# EAGLE design battery_case (EAGLE 9.6.2)
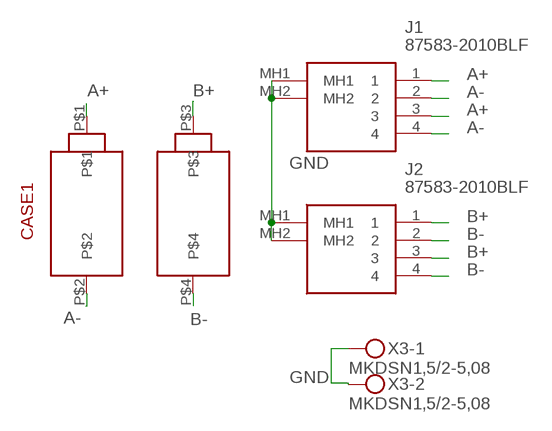
[diagram p0: schematic, sheet 1]

## Parts
CASE1  BATTERY_CASE  [CASE]
J1  87583-2010BLF  [875832010BLF]
J2  87583-2010BLF  [875832010BLF]
X3  MKDSN1,5/2-5,08  [MKDSN1,5/2-5,08]

## Nets
A+: CASE1.P$1 J1.1 J1.3
A-: CASE1.P$2 J1.2 J1.4
B+: CASE1.P$3 J2.1 J2.3
B-: CASE1.P$4 J2.2 J2.4
GND: J1.MH1 J1.MH2 J2.MH1 J2.MH2 X3.1 X3.2

## Library data of the parts
CASE1 = custom_battery_case:BATTERY_CASE
J1 J2 = 87583-2010BLF:87583-2010BLF: USB 2.0, Input Output Connectors, Receptacle, Type A, Standard, Right Angle, Surface Mount, Single Deck, 4 Positions Source: Datasheet <https://cdn.amphenol-cs.com/media/wysiwyg/files/drawing/87583.pdf>; DESCRIPTION: USB 2.0, Input Output Connectors, Receptacle, Type A, Standard, Right Angle, Surface Mount, Single Deck, 4 Positions; HEIGHT: 7.94mm; MANUFACTURER_NAME: Amphenol Communications Solutions; MANUFACTURER_PART_NUMBER: 87583-2010BLF
X3 = con-phoenix-508:MKDSN1,5/2-5,08: MKDSN 1,5/ 2-5,08 Printklemme Nennstrom: 13,5 A Nennspannung: 250 V Rastermaß: 5,08 mm Polzahl: 2 Anschlussart: Schraubanschluss Montage: Löten Anschlussrichtung Leiter/Platine: 0 ° Artikelnummer: 1729128 Source: http://eshop.phoenixcontact.com .. 1729128.pdf

## Board
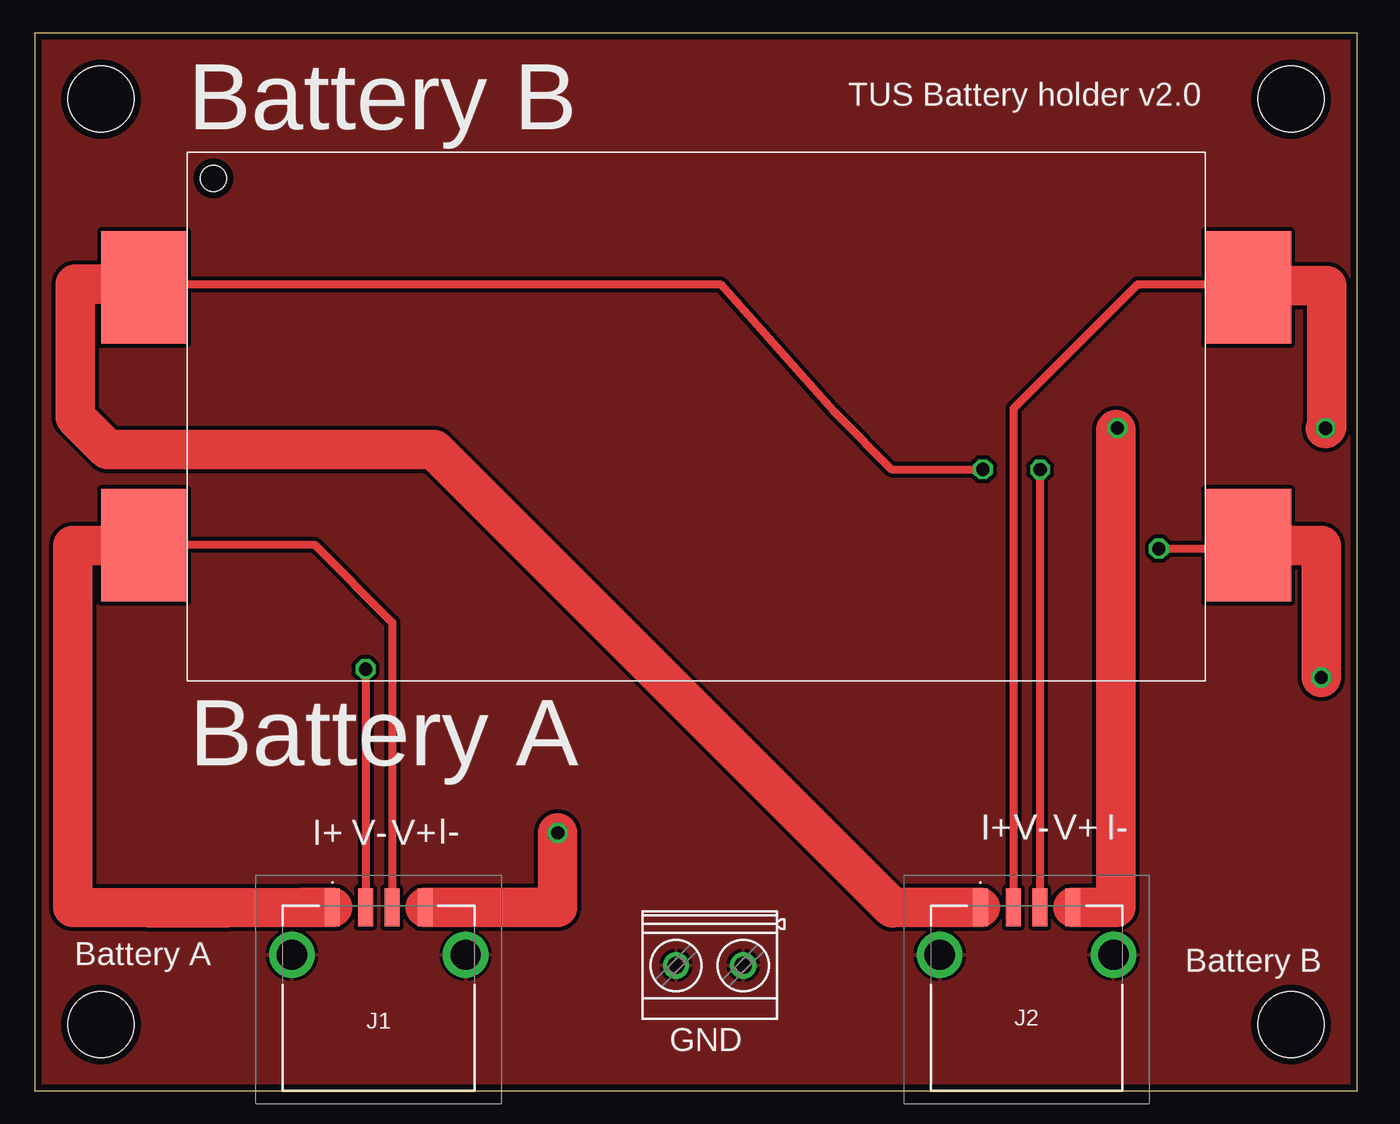
[diagram p1: board, top side]
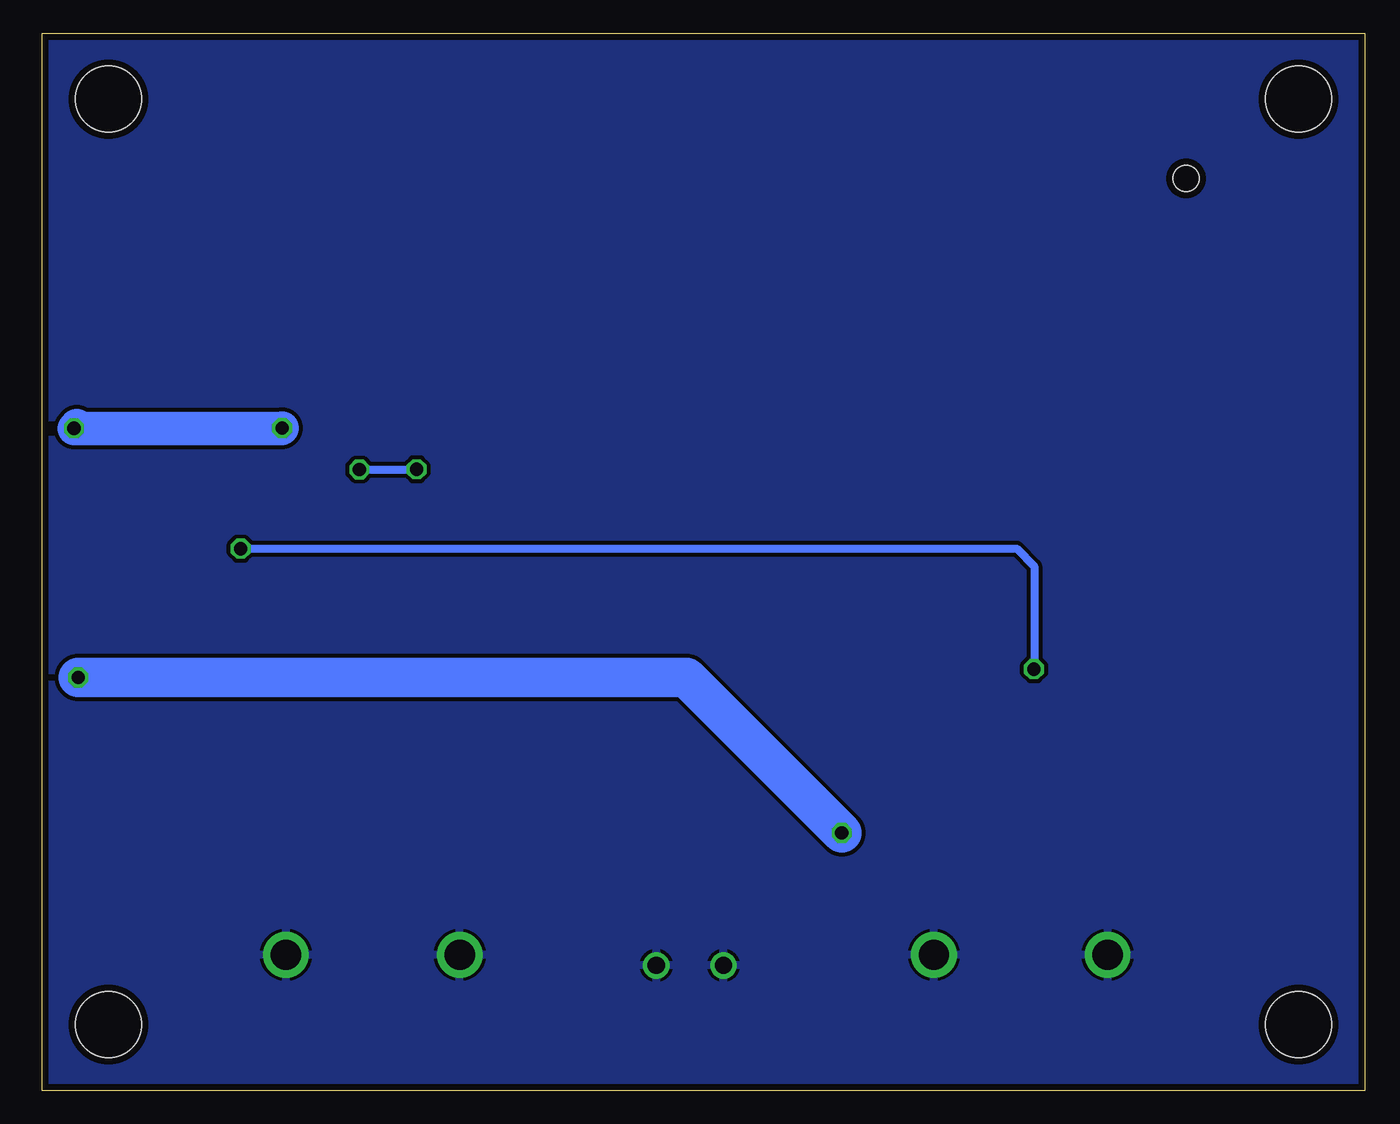
[diagram p2: board, bottom side, seen from below]

Size 100 x 80 mm. Coordinates in mm from the lower left corner, seen from the top.
Outline: 0,0 100,0 100,80 0,80 0,0
Copper layers (1*16): Top 0.035mm / dielectric 1.53mm / Bottom 0.035mm
Design rules "pban_5mil-l2": minimum track width 5mil, minimum drill 0.3mm, track to track 5mil, track to pad 0.229mm, pad to pad 5mil, via to via 5mil, smd to smd 5mil, copper to edge 0.5mm, drill to drill 0.5mm, minimum pad ring 0.15mm, minimum via ring 0.15mm, stop-mask expansion 4mil, vias tented up to drill 0.35mm, thermal gap 10mil
Holes 5 mm at 5,75 95,5 95,75 5,5
Holes 2 mm at 13.5,69

### Footprints (pad centres in the part's own frame; a part is rotated, then mirrored left to right if it is on the bottom)
CASE = smd 6.5 x 8.5: P$1 -41.75,-9.75; P$2 41.75,-9.75; P$3 -41.75,9.75; P$4 41.75,9.75
875832010BLF = smd 1.12 x 2.88: 1 -3.5,6.86; 2 -1,6.86; 3 1,6.86; 4 3.5,6.86 | drill 2.3 pad 3.45: MH1 -6.57,3.28; MH2 6.57,3.28
MKDSN1,5/2-5,08 = drill 1.3 pad 2: 1 -2.561,0.025; 2 2.519,0.025

### Placement (x,y rotation side)
CASE1  50,51 0 top
J1  26,7 0 top
J2  75,7 0 top
X3  51,9.5 180 top

### Tracks (layer width: path | path; a pad name or v marks a point on that pad's centre or on a via)
A+
  Top 0.152: 20.28,13.86
  Top 0.61: CASE1.P$1 8.3,41.3 21.14,41.3 27.01,35.43 27.01,13.86 J1.3
  Top 3: CASE1.P$1 2.86,41.25 2.86,13.86 arc0 20.28,13.86 arc0 J1.1
A-  (via drill 1)
  Top 0.152: 39.54,13.89 39.51,13.86
  Top 0.61: v85,41 91.5,41 CASE1.P$2 | v25,31.89 25.02,31.87 25.02,13.88 J1.2
  Top 3: v97.29,31.27 v97.3,31.27 97.3,41.25 CASE1.P$2 | v39.54,19.5 39.54,13.89 | 39.51,13.86 arc0 J1.4
  Bottom 0.61: v85,41 26.3,41 24.97,39.67 24.97,31.92 v25,31.89
  Bottom 3: v39.54,19.5 51.3,31.27 v97.29,31.27
B+  (via drill 1)
  Top 0.152: 76,15.11 76.02,15.13 | 64.83,13.84 64.86,13.86
  Top 0.61: 8,61 51.84,61 60.41,51.42 60.7,51.09 64.79,47 v71.7,47 | 76.02,15.13 v76.02,46.99 | J2.3 76,15.11
  Top 3: CASE1.P$3 8,61 3.04,61 3.04,50.96 5.5,48.5 30.17,48.5 64.83,13.84 | 64.86,13.86 arc0 J2.1
  Bottom 0.61: v71.7,47 v71.71,46.99 v76.02,46.99
B-  (via drill 1)
  Top 0.152: J2.2 74.02,13.88 | 81.75,13.87 81.74,13.86
  Top 0.61: CASE1.P$4 91.5,61 83.4,61 74.02,51.62 74.02,13.88 | 78.74,14.1 J2.4
  Top 2.54: v81.87,50.12 81.75,50.01
  Top 3: v97.6,50.1 97.7,50.2 97.7,60.9 91.9,60.9 CASE1.P$4 | 81.75,50.01 81.75,13.87 | 81.74,13.86 arc0 J2.4
  Bottom 2.54: 97.4,50.3 v97.6,50.1 81.89,50.1 v81.87,50.12
GND
  pour Top (isolate 0.305): -5,84 106,84 106,-3 -4,-3 -5,-2
  pour Bottom (isolate 0.305): -1,83 106,83 106,-3 -3,-3 -3,83

### Text on the board
tPlace: TUS Battery holder v2.0 | Battery B | Battery A | I+ | V- | V+ | I- | I+ | V- | V+ | I- | Battery A | Battery B | GND